# Altium schematic sheet dac0808.SchDoc
size A
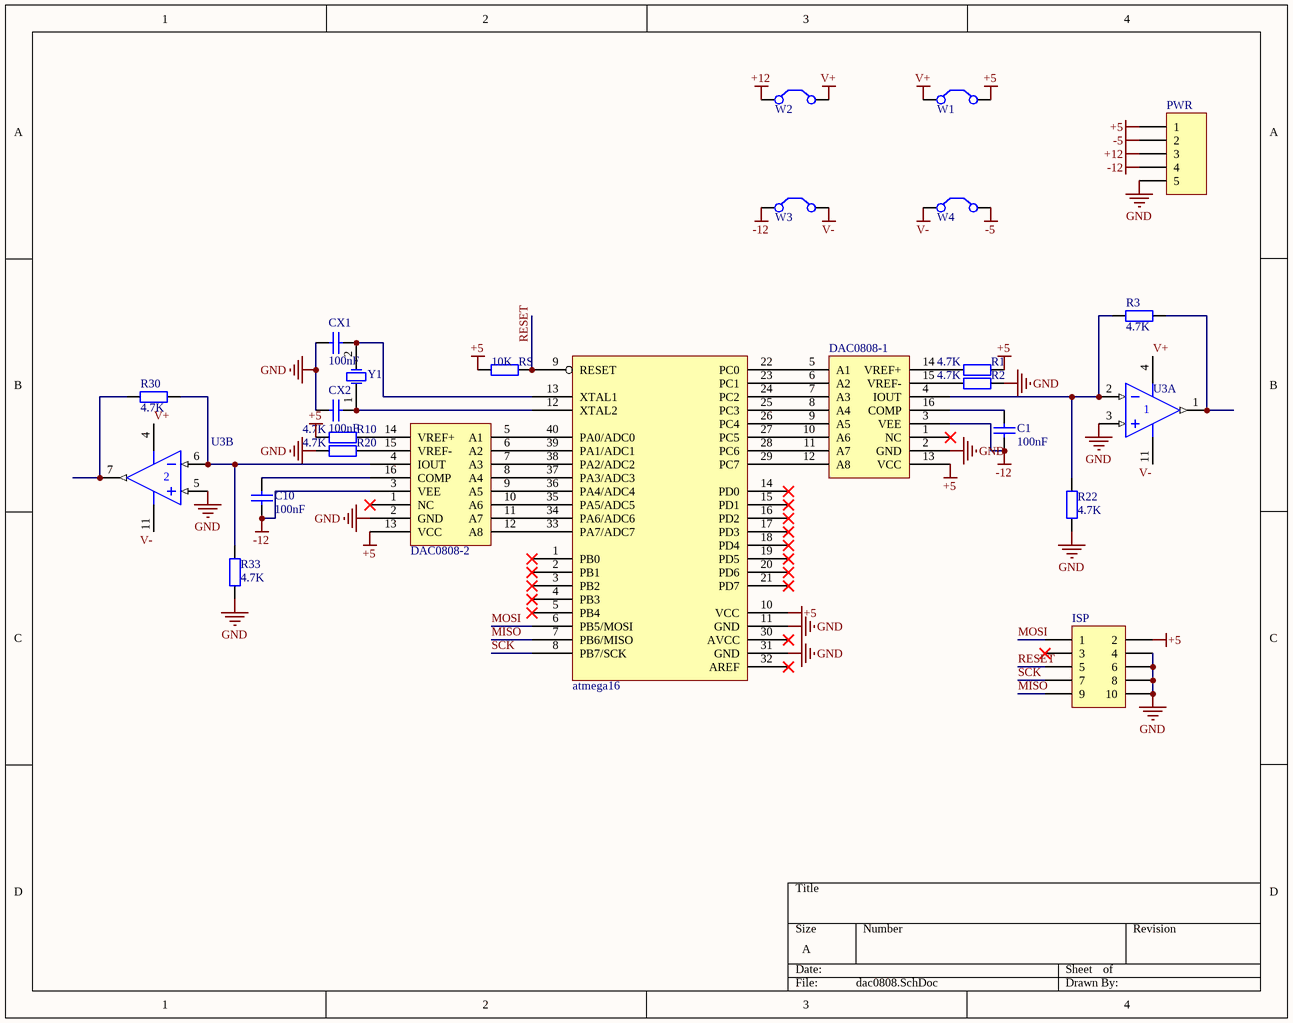
[diagram p0: dac0808.SchDoc]

## Parts
atmega16  atmega16  [DIP-40PIN]  (value not drawn)
C1  value 100nF  [mkt]  (hidden comment: Cap)
C10  value 100nF  [mkt]  (hidden comment: Cap)
CX1  value 100nF  [mkt]  (hidden comment: Cap)
CX2  value 100nF  [mkt]  (hidden comment: Cap)
DAC0808-1  DAC0808  [DIP-16-1]  (value not drawn)
DAC0808-2  DAC0808  [DIP-16-1]  (value not drawn)
ISP  Header 5X2  [HDR2X5]  (value not drawn)
PWR  Header 5  [PWR]  (value not drawn)
R1  value 4.7K  [AXIAL-0.4]  (hidden comment: Res2)
R2  value 4.7K  [AXIAL-0.4]  (hidden comment: Res2)
R3  value 4.7K  [AXIAL-0.4]  (hidden comment: Res2)
R10  value 4.7K  [AXIAL-0.4]  (hidden comment: Res2)
R20  value 4.7K  [AXIAL-0.4]  (hidden comment: Res2)
R22  value 4.7K  [AXIAL-0.4]  (hidden comment: Res2)
R30  value 4.7K  [AXIAL-0.4]  (hidden comment: Res2)
R33  value 4.7K  [AXIAL-0.4]  (hidden comment: Res2)
RS  value 10K  [AXIAL-0.4]  (hidden comment: Res2)
U3  LM324AJ  [J014]  (value not drawn)  (parts A,B of 4)
W1  Jumper  [HDR1X2]  (value not drawn)
W2  Jumper  [HDR1X2]  (value not drawn)
W3  Jumper  [HDR1X2]  (value not drawn)
W4  Jumper  [HDR1X2]  (value not drawn)
Y1  XTAL  [XTAL]  (value not drawn)

## Nets
+5: atmega16.10(VCC) DAC0808-1.13(VCC) DAC0808-2.13(VCC) ISP.2 PWR.1 R1.2 R10.1 RS.1 W1.2(C2)
+12: PWR.3 W2.1(C1)
-5: PWR.2 W4.2(C2)
-12: C1.1 C10.1 DAC0808-1.3(VEE) DAC0808-2.3(VEE) PWR.4 W3.1(C1)
GND: atmega16.11(GND) atmega16.31(GND) CX1.1 CX2.1 DAC0808-1.2(GND) DAC0808-2.2(GND) ISP.4 ISP.6 ISP.8 ISP.10 PWR.5 R2.2 R20.1 R22.1 R33.1 U3.3(IN+) U3.5(IN+)
V+: U3.4(V+) W1.1(C1) W2.2(C2)
V-: U3.11(V-) W3.2(C2) W4.1(C1)
MISO: atmega16.7(PB6/MISO) ISP.9
MOSI: atmega16.6(PB5/MOSI) ISP.1
RESET: atmega16.9(RESET) ISP.5 RS.2
SCK: atmega16.8(PB7/SCK) ISP.7
Netatmega16_12: atmega16.12(XTAL2) CX2.2 Y1.1(OSC1)
Netatmega16_13: atmega16.13(XTAL1) CX1.2 Y1.2(OSC2)
Netatmega16_22: atmega16.22(PC0) DAC0808-1.5(A1)
Netatmega16_23: atmega16.23(PC1) DAC0808-1.6(A2)
Netatmega16_24: atmega16.24(PC2) DAC0808-1.7(A3)
Netatmega16_25: atmega16.25(PC3) DAC0808-1.8(A4)
Netatmega16_26: atmega16.26(PC4) DAC0808-1.9(A5)
Netatmega16_27: atmega16.27(PC5) DAC0808-1.10(A6)
Netatmega16_28: atmega16.28(PC6) DAC0808-1.11(A7)
Netatmega16_29: atmega16.29(PC7) DAC0808-1.12(A8)
Netatmega16_33: atmega16.33(PA7/ADC7) DAC0808-2.12(A8)
Netatmega16_34: atmega16.34(PA6/ADC6) DAC0808-2.11(A7)
Netatmega16_35: atmega16.35(PA5/ADC5) DAC0808-2.10(A6)
Netatmega16_36: atmega16.36(PA4/ADC4) DAC0808-2.9(A5)
Netatmega16_37: atmega16.37(PA3/ADC3) DAC0808-2.8(A4)
Netatmega16_38: atmega16.38(PA2/ADC2) DAC0808-2.7(A3)
Netatmega16_39: atmega16.39(PA1/ADC1) DAC0808-2.6(A2)
Netatmega16_40: atmega16.40(PA0/ADC0) DAC0808-2.5(A1)
NetC1_2: C1.2 DAC0808-1.16(COMP)
NetC10_2: C10.2 DAC0808-2.16(COMP)
NetDAC0808-1_4: DAC0808-1.4(IOUT) R3.1 R22.2 U3.2(IN-)
NetDAC0808-1_14: DAC0808-1.14(VREF+) R1.1
NetDAC0808-1_15: DAC0808-1.15(VREF-) R2.1
NetDAC0808-2_4: DAC0808-2.4(IOUT) R30.2 R33.2 U3.6(IN-)
NetDAC0808-2_14: DAC0808-2.14(VREF+) R10.2
NetDAC0808-2_15: DAC0808-2.15(VREF-) R20.2
NetR3_2: R3.2 U3.1(OUT)
NetR30_1: R30.1 U3.7(OUT)

Not connected (* = marked no-connect by the designer): atmega16 1(PB0)* 2(PB1)* 3(PB2)* 4(PB3)* 5(PB4)* 14(PD0)* 15(PD1)* 16(PD2)* 17(PD3)* 18(PD4)* 19(PD5)* 20(PD6)* 21(PD7)* 30(AVCC)* 32(AREF)*; DAC0808-1 1(NC)*; DAC0808-2 1(NC)*; ISP 3*

## Library data of the parts
C1 C10 CX1 CX2 = Cap: Capacitor; Published: 8-Jun-2000; LatestRevisionDate: 17-Jul-2002; LatestRevisionNote: Re-released for DXP Platform.; PackageReference: RAD-0.3; Publisher: Altium Limited
ISP = Header 5X2: Header, 5-Pin, Dual row; LatestRevisionDate: 17-Jul-2002; LatestRevisionNote: Re-released for DXP Platform.; Publisher: Altium Limited
PWR = Header 5: Header, 5-Pin; LatestRevisionDate: 17-Jul-2002; LatestRevisionNote: Re-released for DXP Platform.; Publisher: Altium Limited
R1-R3 R10 R20 R22 R30 R33 RS = Res2: Resistor; Published: 8-Jun-2000; LatestRevisionDate: 17-Jul-2002; LatestRevisionNote: Re-released for DXP Platform.; PackageReference: AXIAL-0.4; Publisher: Altium Limited
U3 = LM324AJ: Quadruple Operational Amplifier; Published: 15-Apr-2002; LatestRevisionDate: 04-Mar-2005; LatestRevisionNote: Stylized 3D Model Added.; DatasheetVersion: Jan-1989; PackageVersion: Jun-1999; PackageReference: J014; Publisher: Altium Limited; PackageDescription: DIP; 14 Leads; Row Spacing 7.62 mm; Pitch 2.54 mm; ComponentLink1Description: Manufacturer Link; ComponentLink1URL: http://www.ti.com/; ComponentLink2Description: Datasheet; ComponentLink2URL: http://www-s.ti.com/sc/ds/lm324.pdf
W1-W4 = Jumper: Jumper Wire; Published: 24-Mar-1999; LatestRevisionDate: 17-Jul-2002; LatestRevisionNote: Re-released for DXP Platform.; PackageReference: RAD-0.2; Publisher: Altium Limited
Y1 = XTAL: Crystal Oscillator; Published: 8-Jun-2000; LatestRevisionDate: 17-Jul-2002; LatestRevisionNote: Re-released for DXP Platform.; PackageReference: R38; Publisher: Altium Limited